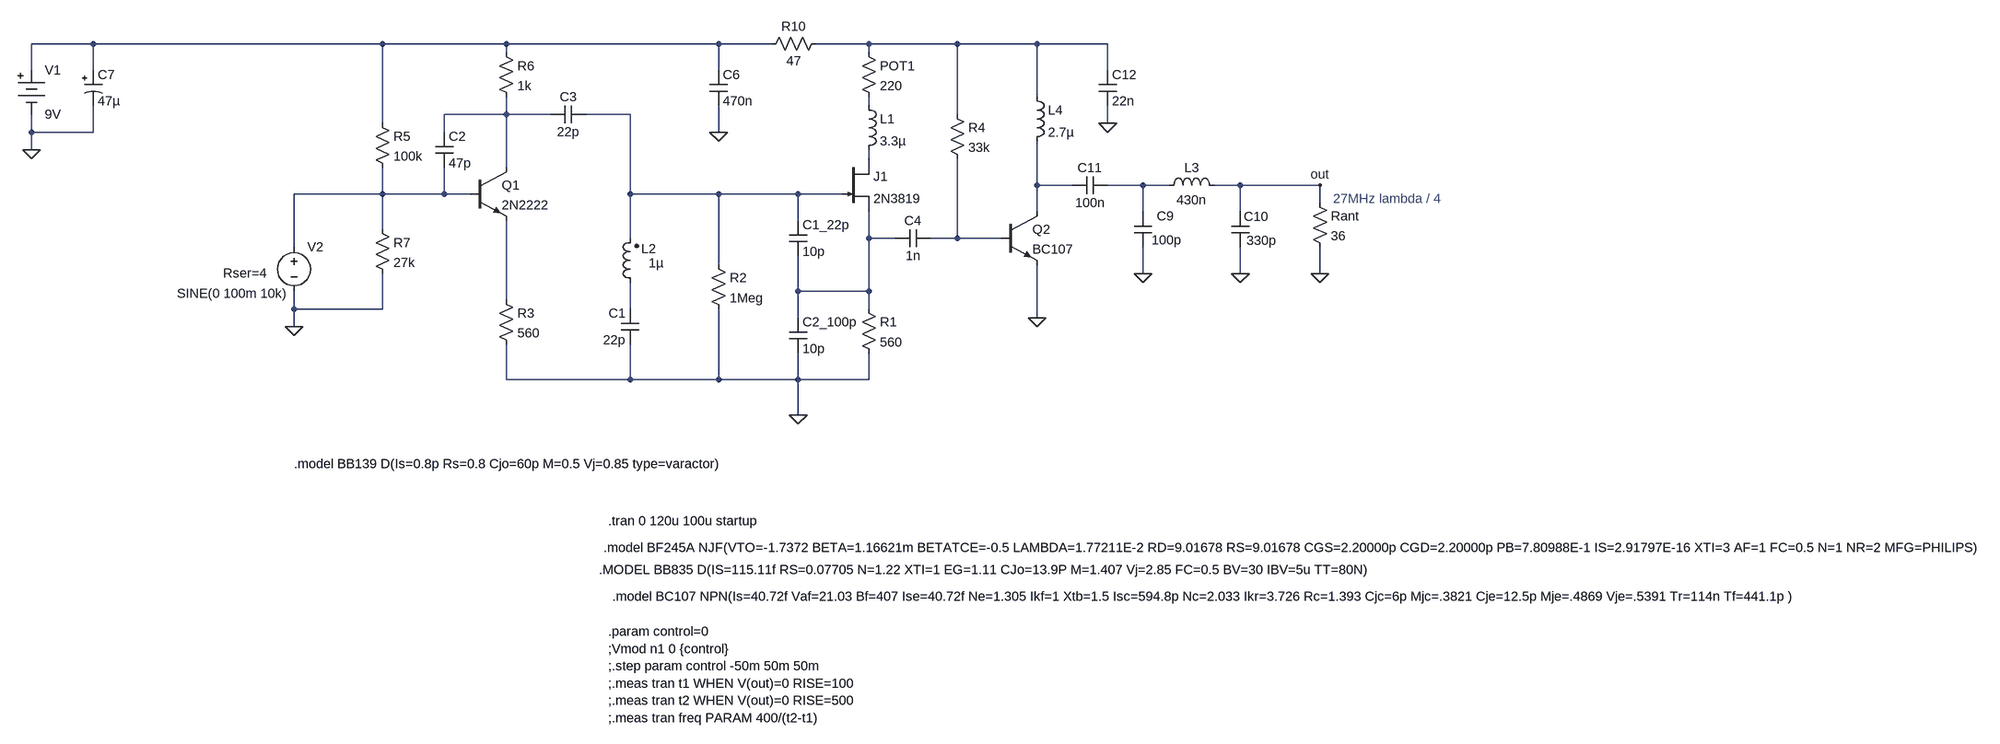
[diagram p0: schematic mini-fm-transmitter-clapp-reactance-modulator.asc]
mini-fm-transmitter-clapp-reactance-modulator.asc, the LTspice schematic file:
Version 4.1
SHEET 1 1176 716
WIRE -2400 -672 -2512 -672
WIRE -1872 -672 -2400 -672
WIRE -1648 -672 -1872 -672
WIRE -1264 -672 -1648 -672
WIRE -1168 -672 -1264 -672
WIRE -992 -672 -1088 -672
WIRE -832 -672 -992 -672
WIRE -688 -672 -832 -672
WIRE -560 -672 -688 -672
WIRE -1648 -656 -1648 -672
WIRE -992 -656 -992 -672
WIRE -2512 -624 -2512 -672
WIRE -2400 -624 -2400 -672
WIRE -1264 -624 -1264 -672
WIRE -560 -624 -560 -672
WIRE -688 -576 -688 -672
WIRE -992 -560 -992 -576
WIRE -1648 -544 -1648 -576
WIRE -1648 -544 -1760 -544
WIRE -1568 -544 -1648 -544
WIRE -1424 -544 -1504 -544
WIRE -832 -544 -832 -672
WIRE -1872 -528 -1872 -672
WIRE -560 -528 -560 -560
WIRE -2512 -512 -2512 -544
WIRE -2400 -512 -2400 -560
WIRE -2400 -512 -2512 -512
WIRE -1760 -512 -1760 -544
WIRE -1264 -512 -1264 -560
WIRE -2512 -480 -2512 -512
WIRE -992 -464 -992 -480
WIRE -1648 -448 -1648 -544
WIRE -688 -416 -688 -496
WIRE -624 -416 -688 -416
WIRE -496 -416 -560 -416
WIRE -448 -416 -496 -416
WIRE -320 -416 -368 -416
WIRE -176 -416 -320 -416
WIRE -1872 -400 -1872 -448
WIRE -1872 -400 -2032 -400
WIRE -1760 -400 -1760 -448
WIRE -1760 -400 -1872 -400
WIRE -1712 -400 -1760 -400
WIRE -1424 -400 -1424 -544
WIRE -1264 -400 -1424 -400
WIRE -1120 -400 -1264 -400
WIRE -1040 -400 -1120 -400
WIRE -176 -384 -176 -416
WIRE -688 -368 -688 -416
WIRE -496 -368 -496 -416
WIRE -320 -368 -320 -416
WIRE -1120 -352 -1120 -400
WIRE -1872 -336 -1872 -400
WIRE -1424 -320 -1424 -400
WIRE -992 -320 -992 -368
WIRE -944 -320 -992 -320
WIRE -832 -320 -832 -464
WIRE -832 -320 -880 -320
WIRE -752 -320 -832 -320
WIRE -2032 -304 -2032 -400
WIRE -1264 -272 -1264 -400
WIRE -496 -256 -496 -304
WIRE -320 -256 -320 -304
WIRE -176 -256 -176 -304
WIRE -1120 -224 -1120 -288
WIRE -992 -224 -992 -320
WIRE -992 -224 -1120 -224
WIRE -1648 -208 -1648 -352
WIRE -2032 -192 -2032 -224
WIRE -1872 -192 -1872 -256
WIRE -1872 -192 -2032 -192
WIRE -1424 -192 -1424 -240
WIRE -992 -192 -992 -224
WIRE -1120 -176 -1120 -224
WIRE -688 -176 -688 -272
WIRE -2032 -160 -2032 -192
WIRE -1648 -64 -1648 -128
WIRE -1424 -64 -1424 -128
WIRE -1424 -64 -1648 -64
WIRE -1264 -64 -1264 -192
WIRE -1264 -64 -1424 -64
WIRE -1120 -64 -1120 -112
WIRE -1120 -64 -1264 -64
WIRE -992 -64 -992 -112
WIRE -992 -64 -1120 -64
WIRE -1120 0 -1120 -64
FLAG -1120 0 0
FLAG -2512 -480 0
FLAG -1264 -512 0
FLAG -688 -176 0
FLAG -496 -256 0
FLAG -320 -256 0
FLAG -176 -256 0
FLAG -560 -528 0
FLAG -176 -416 out
FLAG -2032 -160 0
DATAFLAG -176 -432 ""
SYMBOL cap -1136 -352 R0
SYMATTR InstName C1_22p
SYMATTR Value 10p
SYMBOL cap -1136 -176 R0
SYMATTR InstName C2_100p
SYMATTR Value 10p
SYMBOL res -1008 -208 R0
SYMATTR InstName R1
SYMATTR Value 560
SYMBOL Misc\\battery -2512 -640 R0
SYMATTR InstName V1
SYMATTR Value 9V
SYMBOL ind2 -1408 -224 R180
WINDOW 0 -31 77 Left 2
WINDOW 3 -45 51 Left 2
SYMATTR InstName L2
SYMATTR Value 1µ
SYMATTR SpiceLine Rser=9
SYMBOL njf -1040 -464 R0
SYMATTR InstName J1
SYMATTR Value 2N3819
SYMBOL res -1280 -288 R0
SYMATTR InstName R2
SYMATTR Value 1Meg
SYMBOL res -1008 -672 R0
SYMATTR InstName POT1
SYMATTR Value 220
SYMBOL cap -944 -304 R270
WINDOW 0 32 32 VTop 2
WINDOW 3 0 32 VBottom 2
SYMATTR InstName C4
SYMATTR Value 1n
SYMBOL cap -1280 -624 R0
SYMATTR InstName C6
SYMATTR Value 470n
SYMBOL res -1184 -656 R270
WINDOW 0 32 56 VTop 2
WINDOW 3 0 56 VBottom 2
SYMATTR InstName R10
SYMATTR Value 47
SYMBOL polcap -2416 -624 R0
SYMATTR InstName C7
SYMATTR Value 47µ
SYMBOL ind -1008 -576 R0
SYMATTR InstName L1
SYMATTR Value 3.3µ
SYMBOL cap -480 -304 R180
WINDOW 0 -40 56 Left 2
WINDOW 3 -54 13 Left 2
SYMATTR InstName C9
SYMATTR Value 100p
SYMBOL cap -304 -304 R180
WINDOW 0 -35 55 Left 2
WINDOW 3 -49 12 Left 2
SYMATTR InstName C10
SYMATTR Value 330p
SYMBOL ind -464 -400 R270
WINDOW 0 32 56 VTop 2
WINDOW 3 5 56 VBottom 2
SYMATTR InstName L3
SYMATTR Value 430n
SYMATTR SpiceLine Rser=1m
SYMBOL res -192 -400 R0
SYMATTR InstName Rant
SYMATTR Value 36
SYMBOL ind -704 -592 R0
SYMATTR InstName L4
SYMATTR Value 2.7µ
SYMATTR SpiceLine Rser=10m
SYMBOL cap -560 -432 R90
WINDOW 0 0 32 VBottom 2
WINDOW 3 32 32 VTop 2
SYMATTR InstName C11
SYMATTR Value 100n
SYMBOL npn -752 -368 R0
SYMATTR InstName Q2
SYMATTR Value BC107
SYMBOL res -848 -560 R0
SYMATTR InstName R4
SYMATTR Value 33k
SYMBOL cap -576 -624 R0
SYMATTR InstName C12
SYMATTR Value 22n
SYMBOL npn -1712 -448 R0
SYMATTR InstName Q1
SYMATTR Value 2N2222
SYMBOL res -1664 -224 R0
SYMATTR InstName R3
SYMATTR Value 560
SYMBOL res -1888 -544 R0
SYMATTR InstName R5
SYMATTR Value 100k
SYMBOL cap -1776 -512 R0
SYMATTR InstName C2
SYMATTR Value 47p
SYMBOL cap -1504 -560 R90
WINDOW 0 0 32 VBottom 2
WINDOW 3 32 32 VTop 2
SYMATTR InstName C3
SYMATTR Value 22p
SYMBOL voltage -2032 -320 R0
WINDOW 3 -212 100 Left 2
WINDOW 123 0 0 Left 0
WINDOW 39 -128 63 Left 2
SYMATTR InstName V2
SYMATTR Value SINE(0 100m 10k)
SYMATTR SpiceLine Rser=4
SYMBOL res -1664 -672 R0
SYMATTR InstName R6
SYMATTR Value 1k
SYMBOL res -1888 -352 R0
SYMATTR InstName R7
SYMATTR Value 27k
SYMBOL cap -1408 -128 R180
WINDOW 0 24 56 Left 2
WINDOW 3 24 8 Left 2
SYMATTR InstName C1
SYMATTR Value 22p
TEXT -1464 192 Left 2 !.tran 0 120u 100u startup
TEXT -1472 240 Left 2 !.model BF245A NJF(VTO=-1.7372 BETA=1.16621m BETATCE=-0.5 LAMBDA=1.77211E-2 RD=9.01678 RS=9.01678 CGS=2.20000p CGD=2.20000p PB=7.80988E-1 IS=2.91797E-16 XTI=3 AF=1 FC=0.5 N=1 NR=2 MFG=PHILIPS)
TEXT -1480 280 Left 2 !.MODEL BB835 D(IS=115.11f RS=0.07705 N=1.22 XTI=1 EG=1.11 CJo=13.9P M=1.407 Vj=2.85 FC=0.5 BV=30 IBV=5u TT=80N)
TEXT -152 -392 Left 2 ;27MHz lambda / 4
TEXT -1456 328 Left 2 !.model BC107 NPN(Is=40.72f Vaf=21.03 Bf=407 Ise=40.72f Ne=1.305 Ikf=1 Xtb=1.5 Isc=594.8p Nc=2.033 Ikr=3.726 Rc=1.393 Cjc=6p Mjc=.3821 Cje=12.5p Mje=.4869 Vje=.5391 Tr=114n Tf=441.1p )
TEXT -1464 392 Left 2 !.param control=0\n;Vmod n1 0 {control}\n;.step param control -50m 50m 50m\n;.meas tran t1 WHEN V(out)=0 RISE=100\n;.meas tran t2 WHEN V(out)=0 RISE=500\n;.meas tran freq PARAM 400/(t2-t1)
TEXT -2032 88 Left 2 !.model BB139 D(Is=0.8p Rs=0.8 Cjo=60p M=0.5 Vj=0.85 type=varactor)

The netlist it stands for:
* mini-fm-transmitter-clapp-reactance-modulator.asc
C1_22p N005 N010 10p
C2_100p N010 0 10p
R1 N010 0 560
V1 N001 0 9V
L2 N013 N005 1µ Rser=9
J1 N006 N005 N010 2N3819
R2 N005 0 1Meg
R§POT1 N002 N003 220
C4 N010 N011 1n
C6 N001 0 470n
R10 N001 N002 47
C7 N001 0 47µ
L1 N003 N006 3.3µ
C9 0 N008 100p
C10 0 out 330p
L3 N008 out 430n Rser=1m
Rant out 0 36
L4 N002 N007 2.7µ Rser=10m
C11 N008 N007 100n
Q2 N007 N011 0 0 BC107
R4 N002 N011 33k
C12 N002 0 22n
Q1 N004 N009 N012 0 2N2222
R3 N012 0 560
R5 N001 N009 100k
C2 N004 N009 47p
C3 N005 N004 22p
V2 N009 0 SINE(0 100m 10k) Rser=4
R6 N001 N004 1k
R7 N009 0 27k
C1 0 N013 22p
.model NPN NPN
.model PNP PNP
.lib standard.bjt
.model NJF NJF
.model PJF PJF
.lib standard.jft
.tran 0 120u 100u startup
.model BF245A NJF(VTO=-1.7372 BETA=1.16621m BETATCE=-0.5 LAMBDA=1.77211E-2 RD=9.01678 RS=9.01678 CGS=2.20000p CGD=2.20000p PB=7.80988E-1 IS=2.91797E-16 XTI=3 AF=1 FC=0.5 N=1 NR=2 MFG=PHILIPS)
.MODEL BB835 D(IS=115.11f RS=0.07705 N=1.22 XTI=1 EG=1.11 CJo=13.9P M=1.407 Vj=2.85 FC=0.5 BV=30 IBV=5u TT=80N)
* 27MHz lambda / 4
.model BC107 NPN(Is=40.72f Vaf=21.03 Bf=407 Ise=40.72f Ne=1.305 Ikf=1 Xtb=1.5 Isc=594.8p Nc=2.033 Ikr=3.726 Rc=1.393 Cjc=6p Mjc=.3821 Cje=12.5p Mje=.4869 Vje=.5391 Tr=114n Tf=441.1p )
.param control=0
;Vmod n1 0 {control}
;.step param control -50m 50m 50m
;.meas tran t1 WHEN V(out)=0 RISE=100
;.meas tran t2 WHEN V(out)=0 RISE=500
;.meas tran freq PARAM 400/(t2-t1)
.model BB139 D(Is=0.8p Rs=0.8 Cjo=60p M=0.5 Vj=0.85 type=varactor)
.backanno
.end